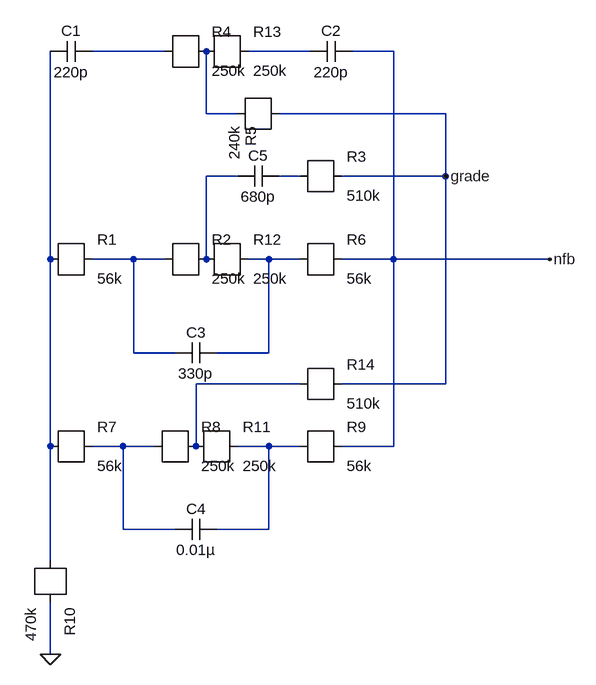
[diagram p0: schematic filtro ativo 1.asc]
filtro ativo 1.asc, the LTspice schematic file:
Version 4
SHEET 1 992 976
WIRE 352 32 240 32
WIRE 576 32 480 32
WIRE 704 32 640 32
WIRE 416 128 416 32
WIRE 464 128 416 128
WIRE 784 128 528 128
WIRE 464 224 416 224
WIRE 560 224 528 224
WIRE 784 224 784 128
WIRE 784 224 624 224
WIRE 176 352 176 32
WIRE 304 352 240 352
WIRE 352 352 304 352
WIRE 416 352 416 224
WIRE 512 352 480 352
WIRE 560 352 512 352
WIRE 704 352 704 32
WIRE 704 352 624 352
WIRE 944 352 704 352
WIRE 304 496 304 352
WIRE 368 496 304 496
WIRE 512 496 512 352
WIRE 512 496 432 496
WIRE 560 544 400 544
WIRE 784 544 784 224
WIRE 784 544 624 544
WIRE 176 640 176 352
WIRE 288 640 240 640
WIRE 336 640 288 640
WIRE 400 640 400 544
WIRE 512 640 464 640
WIRE 560 640 512 640
WIRE 704 640 704 352
WIRE 704 640 624 640
WIRE 288 768 288 640
WIRE 368 768 288 768
WIRE 512 768 512 640
WIRE 512 768 432 768
WIRE 176 816 176 640
WIRE 176 960 176 880
FLAG 176 960 0
FLAG 784 224 grade
FLAG 944 352 nfb
SYMBOL r 176 352 R0
SYMATTR InstName R1
SYMATTR Value 56k
SYMBOL r 352 352 R0
SYMATTR InstName R2
SYMATTR Value 250k
SYMBOL r 560 224 R0
SYMATTR InstName R3
SYMATTR Value 510k
SYMBOL r 352 32 R0
SYMATTR InstName R4
SYMATTR Value 250k
SYMBOL r 464 128 R0
WINDOW 0 20 20 VRight 2
WINDOW 3 -5 18 VRight 2
SYMATTR InstName R5
SYMATTR Value 240k
SYMBOL r 560 352 R0
SYMATTR InstName R6
SYMATTR Value 56k
SYMBOL r 176 640 R0
SYMATTR InstName R7
SYMATTR Value 56k
SYMBOL r 336 640 R0
SYMATTR InstName R8
SYMATTR Value 250k
SYMBOL r 560 640 R0
SYMATTR InstName R9
SYMATTR Value 56k
SYMBOL r 176 816 R90
SYMATTR InstName R10
SYMATTR Value 470k
SYMBOL cap 240 16 R90
WINDOW 0 0 32 VBottom 2
WINDOW 3 32 32 VTop 2
SYMATTR InstName C1
SYMATTR Value 220p
SYMBOL cap 640 16 R90
WINDOW 0 0 32 VBottom 2
WINDOW 3 32 32 VTop 2
SYMATTR InstName C2
SYMATTR Value 220p
SYMBOL cap 432 480 R90
WINDOW 0 0 32 VBottom 2
WINDOW 3 32 32 VTop 2
SYMATTR InstName C3
SYMATTR Value 330p
SYMBOL cap 432 752 R90
WINDOW 0 0 32 VBottom 2
WINDOW 3 32 32 VTop 2
SYMATTR InstName C4
SYMATTR Value 0.01µ
SYMBOL r 400 640 R0
SYMATTR InstName R11
SYMATTR Value 250k
SYMBOL r 416 352 R0
SYMATTR InstName R12
SYMATTR Value 250k
SYMBOL r 416 32 R0
SYMATTR InstName R13
SYMATTR Value 250k
SYMBOL cap 528 208 R90
WINDOW 0 0 32 VBottom 2
WINDOW 3 32 32 VTop 2
SYMATTR InstName C5
SYMATTR Value 680p
SYMBOL r 560 544 R0
SYMATTR InstName R14
SYMATTR Value 510k

The netlist it stands for:
* filtro ativo 1.asc
R1 N007 N006 56k
R2 N004 N007 250k
R3 grade N005 510k
R4 N003 N001 250k
R5 grade N003 240k
R6 nfb N008 56k
R7 N010 N006 56k
R8 N009 N010 250k
R9 nfb N011 56k
R10 0 N006 470k
C1 N001 N006 220p
C2 nfb N002 220p
C3 N008 N007 330p
C4 N011 N010 0.01µ
R11 N011 N009 250k
R12 N008 N004 250k
R13 N002 N003 250k
C5 N005 N004 680p
R14 grade N009 510k
.backanno
.end